# EAGLE design power_switch_led_breakout (EAGLE 9.6.0)
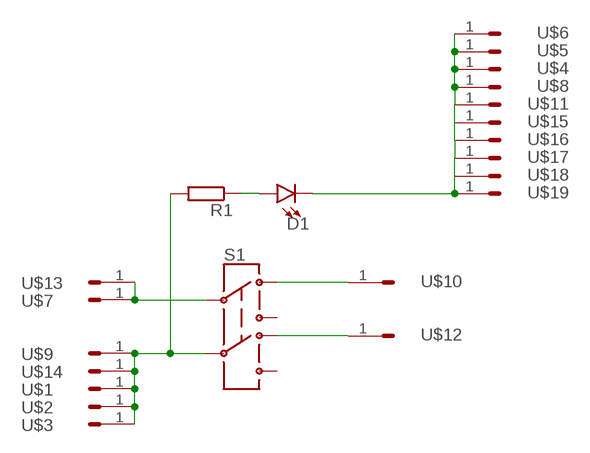
[diagram p0: schematic, sheet 1]

## Parts
D1  LED5MM  [LED_5MM]
R1  RESISTORRESISTOR/UPRIGHT/7.5  [RESISTOR/7.5]
S1  SWITCH-DPDTPTH1  [SWITCH-DPDT_SUBMINIATURE]
U$1  HEADER/MALE/01NOBORDER  [HEADER/MALE/01/NOBORDER]
U$2  HEADER/MALE/01NOBORDER  [HEADER/MALE/01/NOBORDER]
U$3  HEADER/MALE/01NOBORDER  [HEADER/MALE/01/NOBORDER]
U$4  HEADER/MALE/01NOBORDER  [HEADER/MALE/01/NOBORDER]
U$5  HEADER/MALE/01NOBORDER  [HEADER/MALE/01/NOBORDER]
U$6  HEADER/MALE/01NOBORDER  [HEADER/MALE/01/NOBORDER]
U$7  HEADER/MALE/01NOBORDER  [HEADER/MALE/01/NOBORDER]
U$8  HEADER/MALE/01NOBORDER  [HEADER/MALE/01/NOBORDER]
U$9  HEADER/MALE/01NOBORDER  [HEADER/MALE/01/NOBORDER]
U$10  HEADER/MALE/01NOBORDER  [HEADER/MALE/01/NOBORDER]
U$11  HEADER/MALE/01NOBORDER  [HEADER/MALE/01/NOBORDER]
U$12  HEADER/MALE/01NOBORDER  [HEADER/MALE/01/NOBORDER]
U$13  HEADER/MALE/01NOBORDER  [HEADER/MALE/01/NOBORDER]
U$14  HEADER/MALE/01NOBORDER  [HEADER/MALE/01/NOBORDER]
U$15  HEADER/MALE/01NOBORDER  [HEADER/MALE/01/NOBORDER]
U$16  HEADER/MALE/01NOBORDER  [HEADER/MALE/01/NOBORDER]
U$17  HEADER/MALE/01NOBORDER  [HEADER/MALE/01/NOBORDER]
U$18  HEADER/MALE/01NOBORDER  [HEADER/MALE/01/NOBORDER]
U$19  HEADER/MALE/01NOBORDER  [HEADER/MALE/01/NOBORDER]

## Nets
N$1: S1.2 U$7.1 U$13.1
N$2: S1.1 U$10.1
N$3: D1.A R1.1
N$6: S1.4 U$12.1
N$7: D1.K(C) U$4.1 U$5.1 U$6.1 U$8.1 U$11.1 U$15.1 U$16.1 U$17.1 U$18.1 U$19.1
N$8: R1.2 S1.5 U$1.1 U$2.1 U$3.1 U$9.1 U$14.1
Unconnected: S1.3 S1.6

## Library data of the parts
D1 = SparkFun-LED:LED: LED (Generic) Standard schematic elements and footprints for 5mm, 3mm, 1206, and 0603 sized LEDs. Generic LEDs with no color specified.
R1 = resistors:RESISTOR: RESISTOR, European symbol
S1 = electromechanical:SWITCH-DPDT: DPDT Version of the COM-00597
U$1-U$19 = connectors:HEADER/MALE/01

## Board
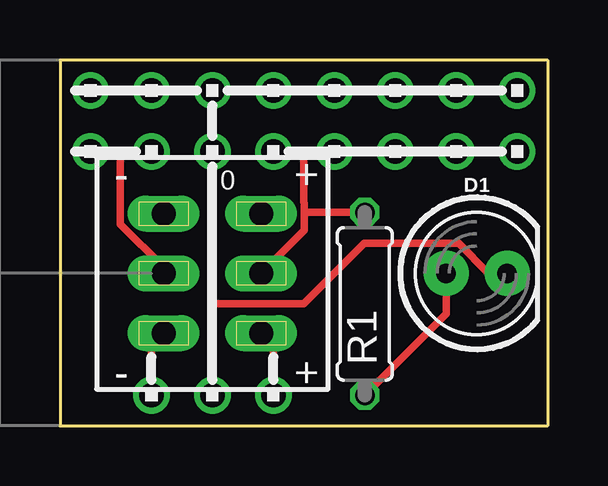
[diagram p1: board, top side]
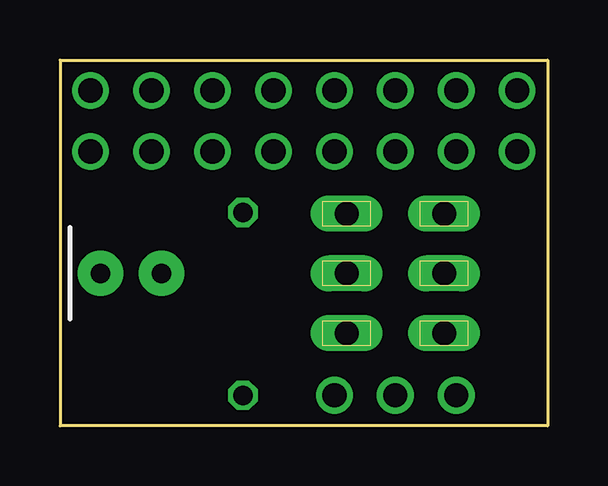
[diagram p2: board, bottom side, seen from below]

Size 20.32 x 15.24 mm. Coordinates in mm from the lower left corner, seen from the top.
Outline: 20.32,15.24 0,15.24 0,0 20.32,0 20.32,15.24
Copper layers (1*16): Top 0.0356mm / dielectric 1.5011mm / Bottom 0.0356mm
Design rules "oshpark": minimum track width 6mil, minimum drill 13mil, track to track 6mil, track to pad 6mil, pad to pad 6mil, via to via 6mil, smd to smd 6mil, copper to edge 15mil, drill to drill 6mil, minimum pad ring 7mil, minimum via ring 7mil, stop-mask expansion 4mil, vias tented up to drill 0mil, thermal gap 10mil

### Footprints (pad centres in the part's own frame; a part is rotated, then mirrored left to right if it is on the bottom)
LED_5MM = drill 0.813 pad 1.88: A -1.27,0; K 1.27,0
RESISTOR/7.5 = drill 0.813 octagon: 1 -3.81,0; 2 3.81,0
SWITCH-DPDT_SUBMINIATURE = drill 1 pad 1.422 long: 1 -2.032,-2.489; 2 -2.032,0; 3 -2.032,2.489; 4 2.032,-2.489; 5 2.032,0; 6 2.032,2.489
HEADER/MALE/01/NOBORDER = drill 1.016: 1 0,0

### Placement (x,y rotation side)
D1  17.36,6.35 0 top
R1  12.7,5.08 90 top
S1  6.35,6.35 0 top
U$1  13.97,11.43 0 top
U$2  16.51,11.43 0 top
U$3  19.05,11.43 0 top
U$4  16.51,13.97 0 top
U$5  19.05,13.97 0 top
U$6  13.97,13.97 0 top
U$7  3.81,11.43 0 top
U$8  6.35,11.43 0 top
U$9  8.89,11.43 0 top
U$10  3.81,1.27 0 top
U$11  6.35,1.27 0 top
U$12  8.89,1.27 0 top
U$13  1.27,11.43 0 top
U$14  11.43,11.43 0 top
U$15  1.27,13.97 0 top
U$16  6.35,13.97 0 top
U$17  11.43,13.97 0 top
U$18  8.89,13.97 0 top
U$19  3.81,13.97 0 top

### Tracks (layer width: path | path; a pad name or v marks a point on that pad's centre or on a via)
N$1
  Top 0.305: S1.2 4.32,6.6 2.51,8.4 2.51,11.4 2.54,11.43 | U$13.1 2.54,11.43 | 2.54,11.43 U$7.1
N$2
  Top 0.305: U$10.1 3.81,3.35 S1.1
N$3
  Top 0.305: R1.1 16.09,4.66 D1.A
N$6
  Top 0.305: U$12.1 8.89,3.35 S1.4
N$7
  Top 0.305: U$11.1 6.35,5.08 | 6.35,5.08 U$8.1 U$16.1 | U$16.1 U$19.1 U$15.1 | U$16.1 U$18.1 U$17.1 U$6.1 U$4.1 U$5.1 | D1.K 17.85,6.35 16.61,7.59 12.68,7.59 10.16,5.08 6.35,5.08
N$8
  Top 0.305: S1.5 10.19,8.16 10.19,8.89 | 10.19,8.89 10.19,9.28 10.16,9.3 10.16,11.43 | U$3.1 U$2.1 U$1.1 U$14.1 10.16,11.43 | U$9.1 10.16,11.43 | R1.2 10.19,8.89

### Text on the board
tNames: - | 0 | + | - | +
tValues: 0